# EAGLE schematic Super_Clokk_199774_2015_03_30 (EAGLE 6.4)
Assembly variants: Prototyp

## Sheet 1 of 6
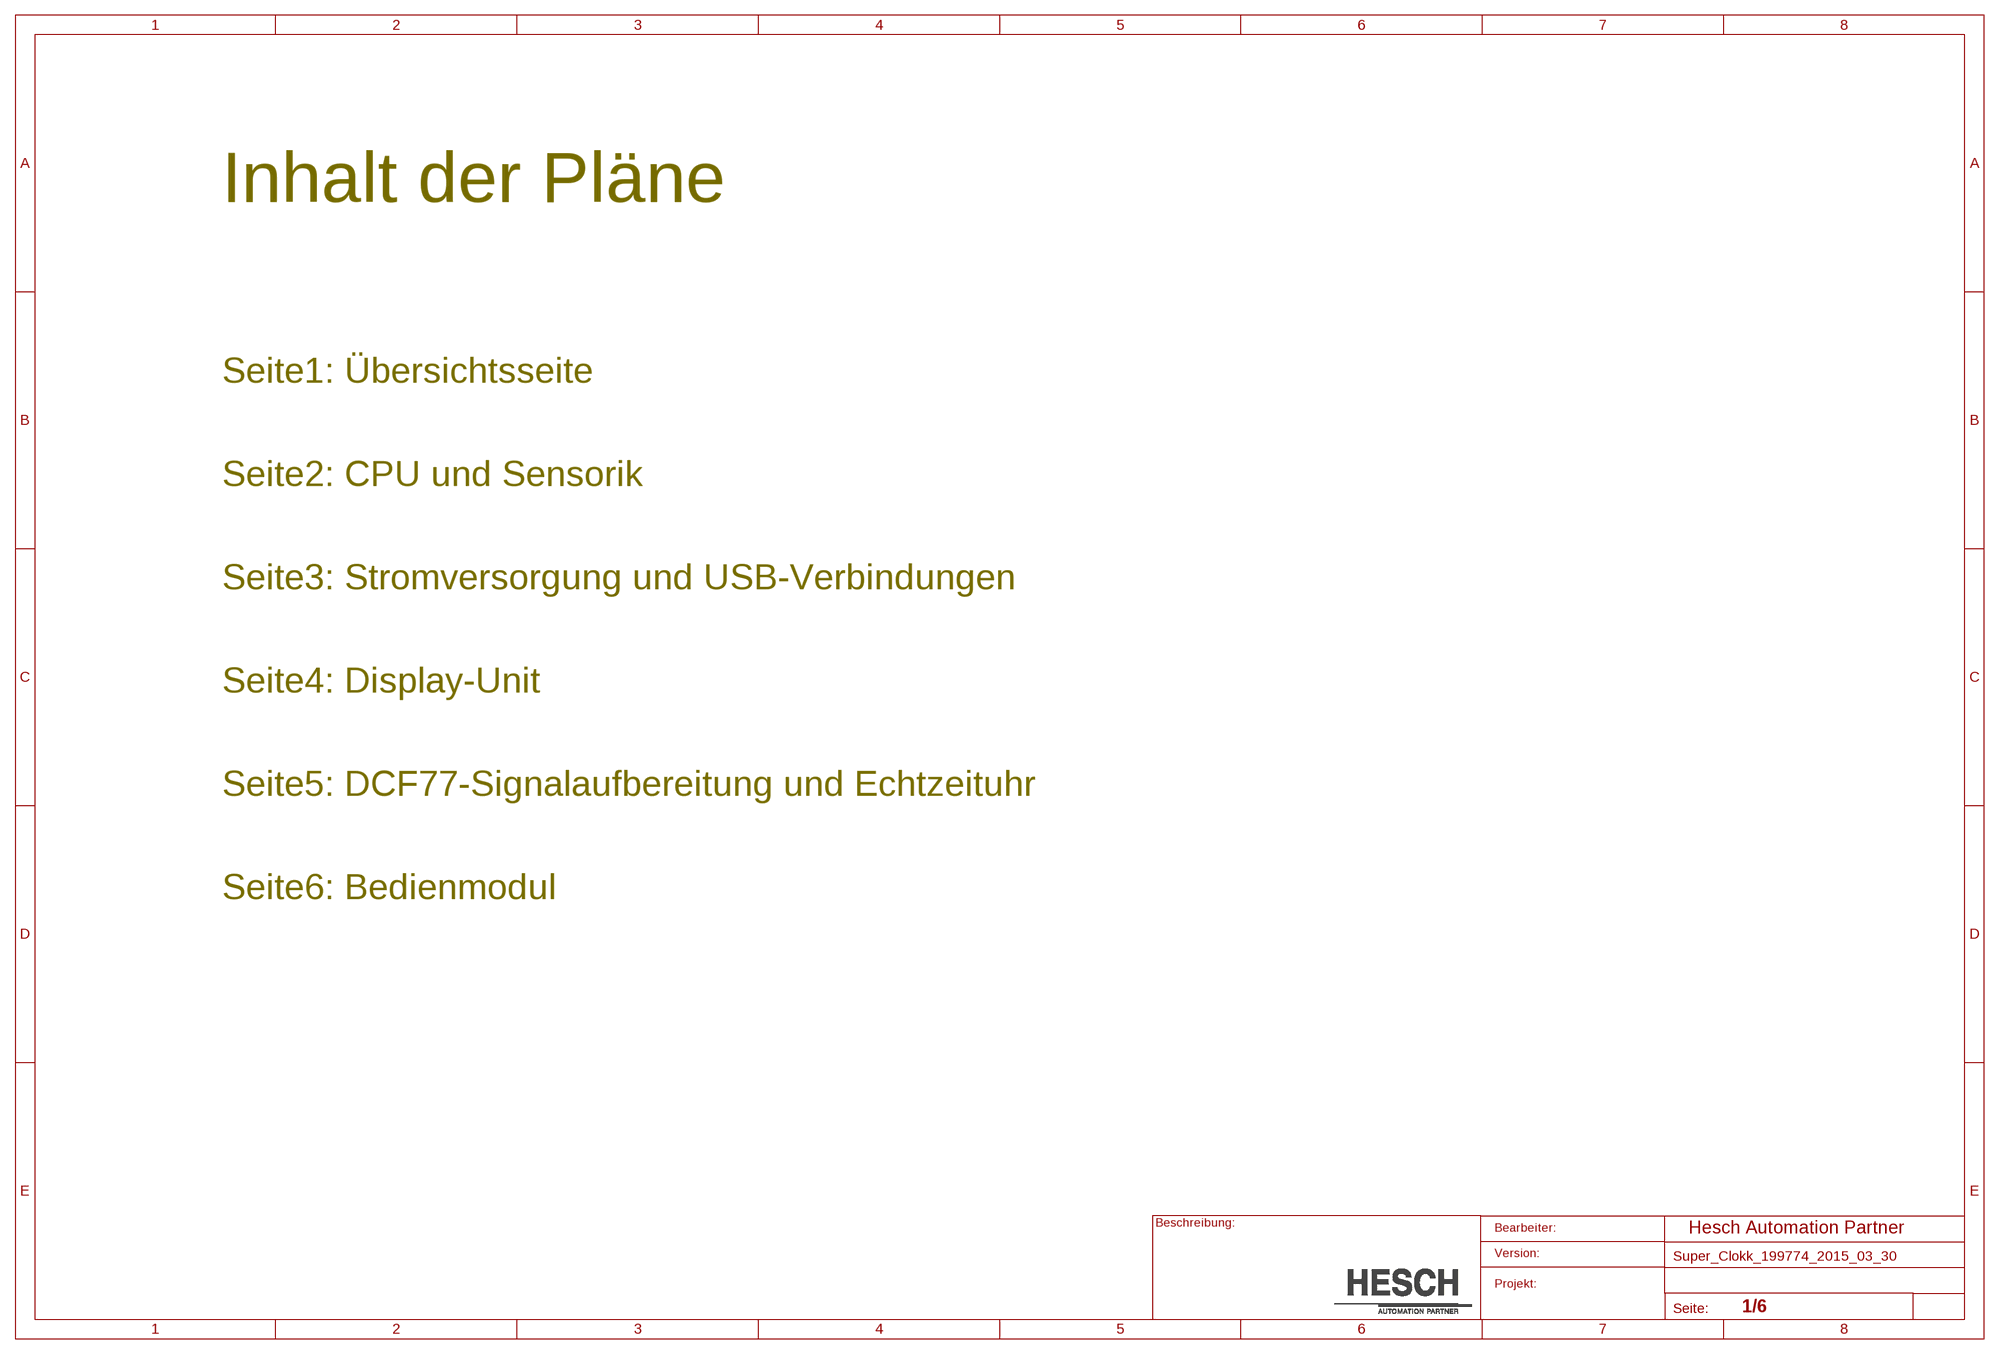
[diagram p0: schematic, sheet 1]

### Notes on the sheet
- Inhalt der Pläne
- Seite1: Übersichtsseite
- Seite2: CPU und Sensorik
- Seite3: Stromversorgung und USB-Verbindungen
- Seite4: Display-Unit
- Seite5: DCF77-Signalaufbereitung und Echtzeituhr
- Seite6: Bedienmodul

## Sheet 2 of 6
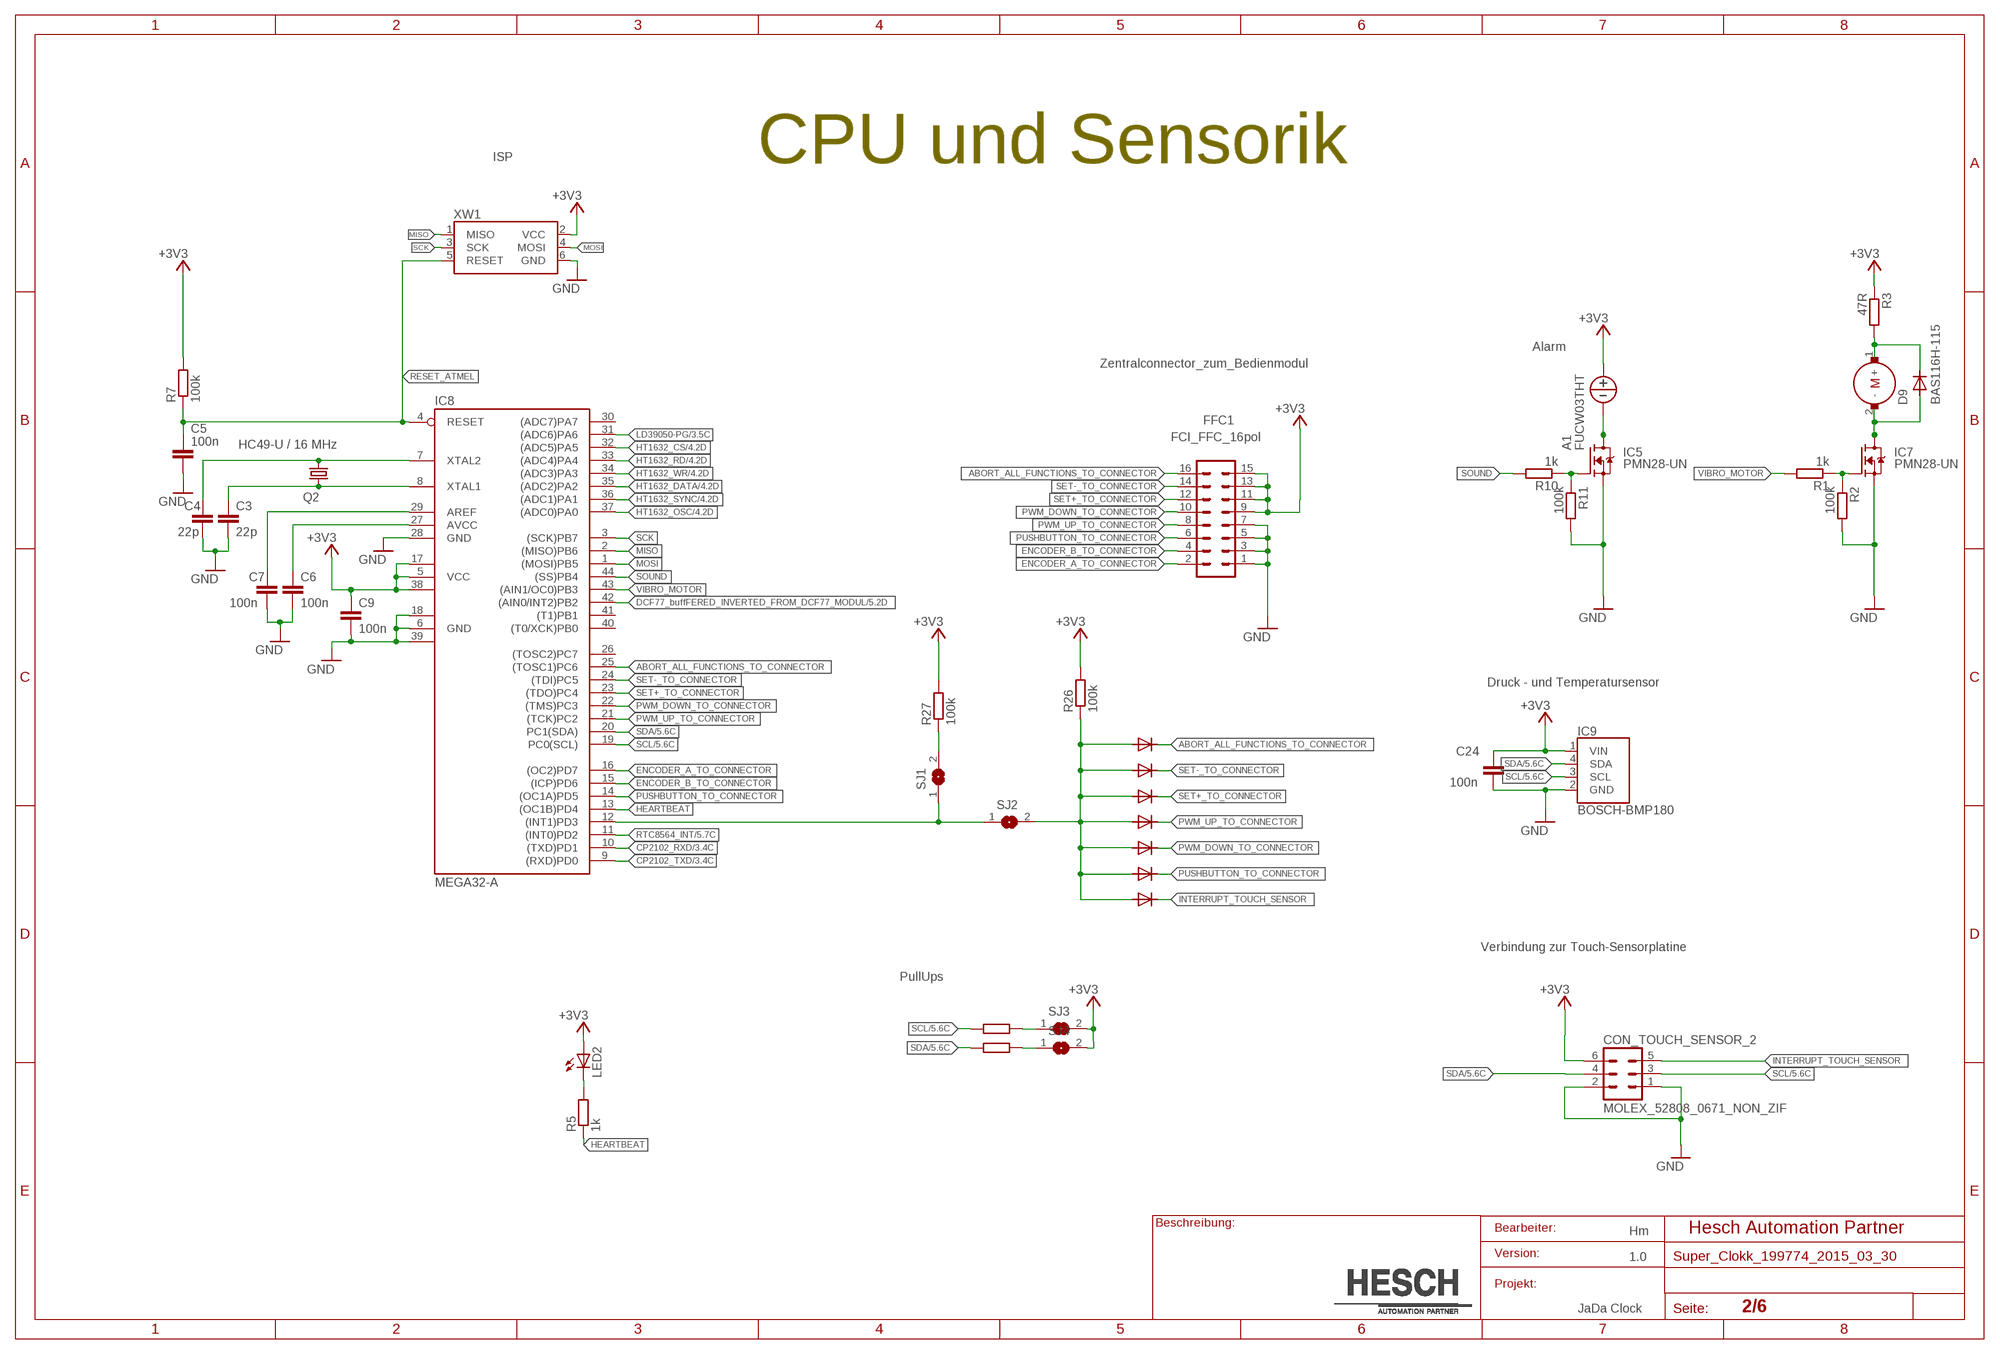
[diagram p1: schematic, sheet 2]

### Parts
A1  FUCW03THT  [FUCW03]  (not fitted in variant Prototyp)
C3  22p  C-EUC0805K  [C0805K]
C4  22p  C-EUC0805K  [C0805K]
C5  100n  C-EUC0805  [C0805]
C6  100n  C-EUC0805  [C0805]
C7  100n  C-EUC0805  [C0805]
C9  100n  C-EUC0805  [C0805]
C24  100n  C-EUC0805  [C0805]
CON_TOUCH_SENSOR_2  MOLEX_52808_0671_NON_ZIF  [MOLEX_52808-0671_NON_ZIF]
D2  BAS116H-115  [SOD123]
D3  BAS116H-115  [SOD123]
D4  BAS116H-115  [SOD123]
D5  BAS116H-115  [SOD123]
D6  BAS116H-115  [SOD123]
D8  BAS116H-115  [SOD123]
D9  BAS116H-115  [SOD123]
D10  BAS116H-115  [SOD123]
FFC1  FCI_FFC_16pol  MOLEX_52808-1671_NON_ZIF  [MOLEX_52808_1671_NON_ZIF]
IC5  PMN28-UN  [SOT457]
IC7  PMN28-UN  [SOT457]
IC8  MEGA32-A  [TQFP44]
IC9  BOSCH-BMP180  [10X13MM]
LED2  LEDCHIPLED_0805  [CHIPLED_0805]
M1  VIBROMOTORTHT432A  [LA4-432A]
Q2  HC49-U / 16 MHz  HC49-U  [HC49]
R1  1k  R-EU_R0805  [R0805]
R2  100k  R-EU_R0805  [R0805]
R3  47R  R-EU_R0805  [R0805]
R5  1k  R-EU_R0805  [R0805]
R7  100k  R-EU_R0805  [R0805]
R10  1k  R-EU_R0805  [R0805]
R11  100k  R-EU_R0805  [R0805]
R26  100k  R-EU_R0805  [R0805]
R27  100k  R-EU_R0805  [R0805]
R52  4,7k  R-EU_R0805  [R0805]
R53  4,7k  R-EU_R0805  [R0805]
SJ1  SJ  [SJ]
SJ2  SJ  [SJ]
SJ3  SJ  [SJ]
SJ4  SJ  [SJ]
XW1  WSL6  [WSL]

### Nets
+3V3: A1.+ C9.1 C24.1 CON_TOUCH_SENSOR_2.6 FFC1.9 FFC1.11 FFC1.13 FFC1.15 IC8.5(VCC) IC8.17(VCC1) IC8.38(VCC2) IC9.1(VIN) LED2.A R3.1 R7.2 R26.2 R27.2 SJ3.2 SJ4.2 XW1.2(VCC) ; also sheet 3,4,5
ABORT_ALL_FUNCTIONS_TO_CONNECTOR: D2.C FFC1.16 IC8.25((TOSC1)PC6)
AREF: C7.1 IC8.29(AREF)
AVCC: C6.1 IC8.27(AVCC)
CP2102_RXD: IC8.10((TXD)PD1) ; also sheet 3
CP2102_TXD: IC8.9((RXD)PD0) ; also sheet 3
DCF77_buffFERED_INVERTED_FROM_DCF77_MODUL: IC8.42((AIN0/INT2)PB2) ; also sheet 5
EINGABE?: D2.A D3.A D4.A D5.A D6.A D8.A D10.A R26.1 SJ2.2
ENCODER_A_TO_CONNECTOR: FFC1.2 IC8.16((OC2)PD7)
ENCODER_B_TO_CONNECTOR: FFC1.4 IC8.15((ICP)PD6)
GND: C3.2 C4.2 C5.2 C6.2 C7.2 C9.2 C24.2 CON_TOUCH_SENSOR_2.1 CON_TOUCH_SENSOR_2.2 FFC1.1 FFC1.3 FFC1.5 FFC1.7 IC5.4(S) IC7.4(S) IC8.6(GND) IC8.18(GND1) IC8.28(GND) IC8.39(GND2) IC9.2(GND) R2.2 R11.2 XW1.6(GND) ; also sheet 3,4,5
HEARTBEAT: IC8.13((OC1B)PD4) R5.1
HT1632_CS: IC8.32((ADC5)PA5) ; also sheet 4
HT1632_DATA: IC8.35((ADC2)PA2) ; also sheet 4
HT1632_OSC: IC8.37((ADC0)PA0) ; also sheet 4
HT1632_RD: IC8.33((ADC4)PA4) ; also sheet 4
HT1632_SYNC: IC8.36((ADC1)PA1) ; also sheet 4
HT1632_WR: IC8.34((ADC3)PA3) ; also sheet 4
INTERRUPT_TOUCH_SENSOR: CON_TOUCH_SENSOR_2.5 D8.C
LD39050-PG: IC8.31((ADC6)PA6) ; also sheet 3
MISO: IC8.2((MISO)PB6) XW1.1(MISO)
MOSI: IC8.1((MOSI)PB5) XW1.4(MOSI)
N$1: A1.- IC5.1(D) IC5.2(D) IC5.5(D) IC5.6(D)
N$2: R52.2 SJ3.1
N$3: R53.2 SJ4.1
N$5: IC7.3(G) R1.1 R2.1
N$8: D9.A IC7.1(D) IC7.2(D) IC7.5(D) IC7.6(D) M1.2(-)
N$9: D9.C M1.1(+) R3.2
N$15: IC5.3(G) R10.1 R11.1
N$16: LED2.C R5.2
N$24: IC8.12((INT1)PD3) SJ1.1 SJ2.1
N$50: R27.1 SJ1.2
PUSHBUTTON_TO_CONNECTOR: D6.C FFC1.6 IC8.14((OC1A)PD5)
PWM_DOWN_TO_CONNECTOR: D10.C FFC1.10 IC8.22((TMS)PC3)
PWM_UP_TO_CONNECTOR: D5.C FFC1.8 IC8.21((TCK)PC2)
RESET_ATMEL: C5.1 IC8.4(RESET) R7.1 XW1.5(RESET)
RTC8564_INT: IC8.11((INT0)PD2) ; also sheet 5
SCK: IC8.3((SCK)PB7) XW1.3(SCK)
SCL: CON_TOUCH_SENSOR_2.3 IC8.19(PC0(SCL)) IC9.3(SCL) R52.1 ; also sheet 5
SDA: CON_TOUCH_SENSOR_2.4 IC8.20(PC1(SDA)) IC9.4(SDA) R53.1 ; also sheet 5
SET+_TO_CONNECTOR: D4.C FFC1.12 IC8.23((TDO)PC4)
SET-_TO_CONNECTOR: D3.C FFC1.14 IC8.24((TDI)PC5)
SOUND: IC8.44((SS)PB4) R10.2
VIBRO_MOTOR: IC8.43((AIN1/OC0)PB3) R1.2
XTAL_1: C3.1 IC8.8(XTAL1) Q2.1
XTAL_2: C4.1 IC8.7(XTAL2) Q2.2
Unconnected: IC8.26((TOSC2)PC7) IC8.30((ADC7)PA7) IC8.40((T0/XCK)PB0) IC8.41((T1)PB1)

### Notes on the sheet
- ISP | CPU und Sensorik
- Alarm
- Zentralconnector_zum_Bedienmodul
- Druck - und Temperatursensor
- Verbindung zur Touch-Sensorplatine
- PullUps
- Hm
- 1.0
- JaDa Clock

## Sheet 3 of 6
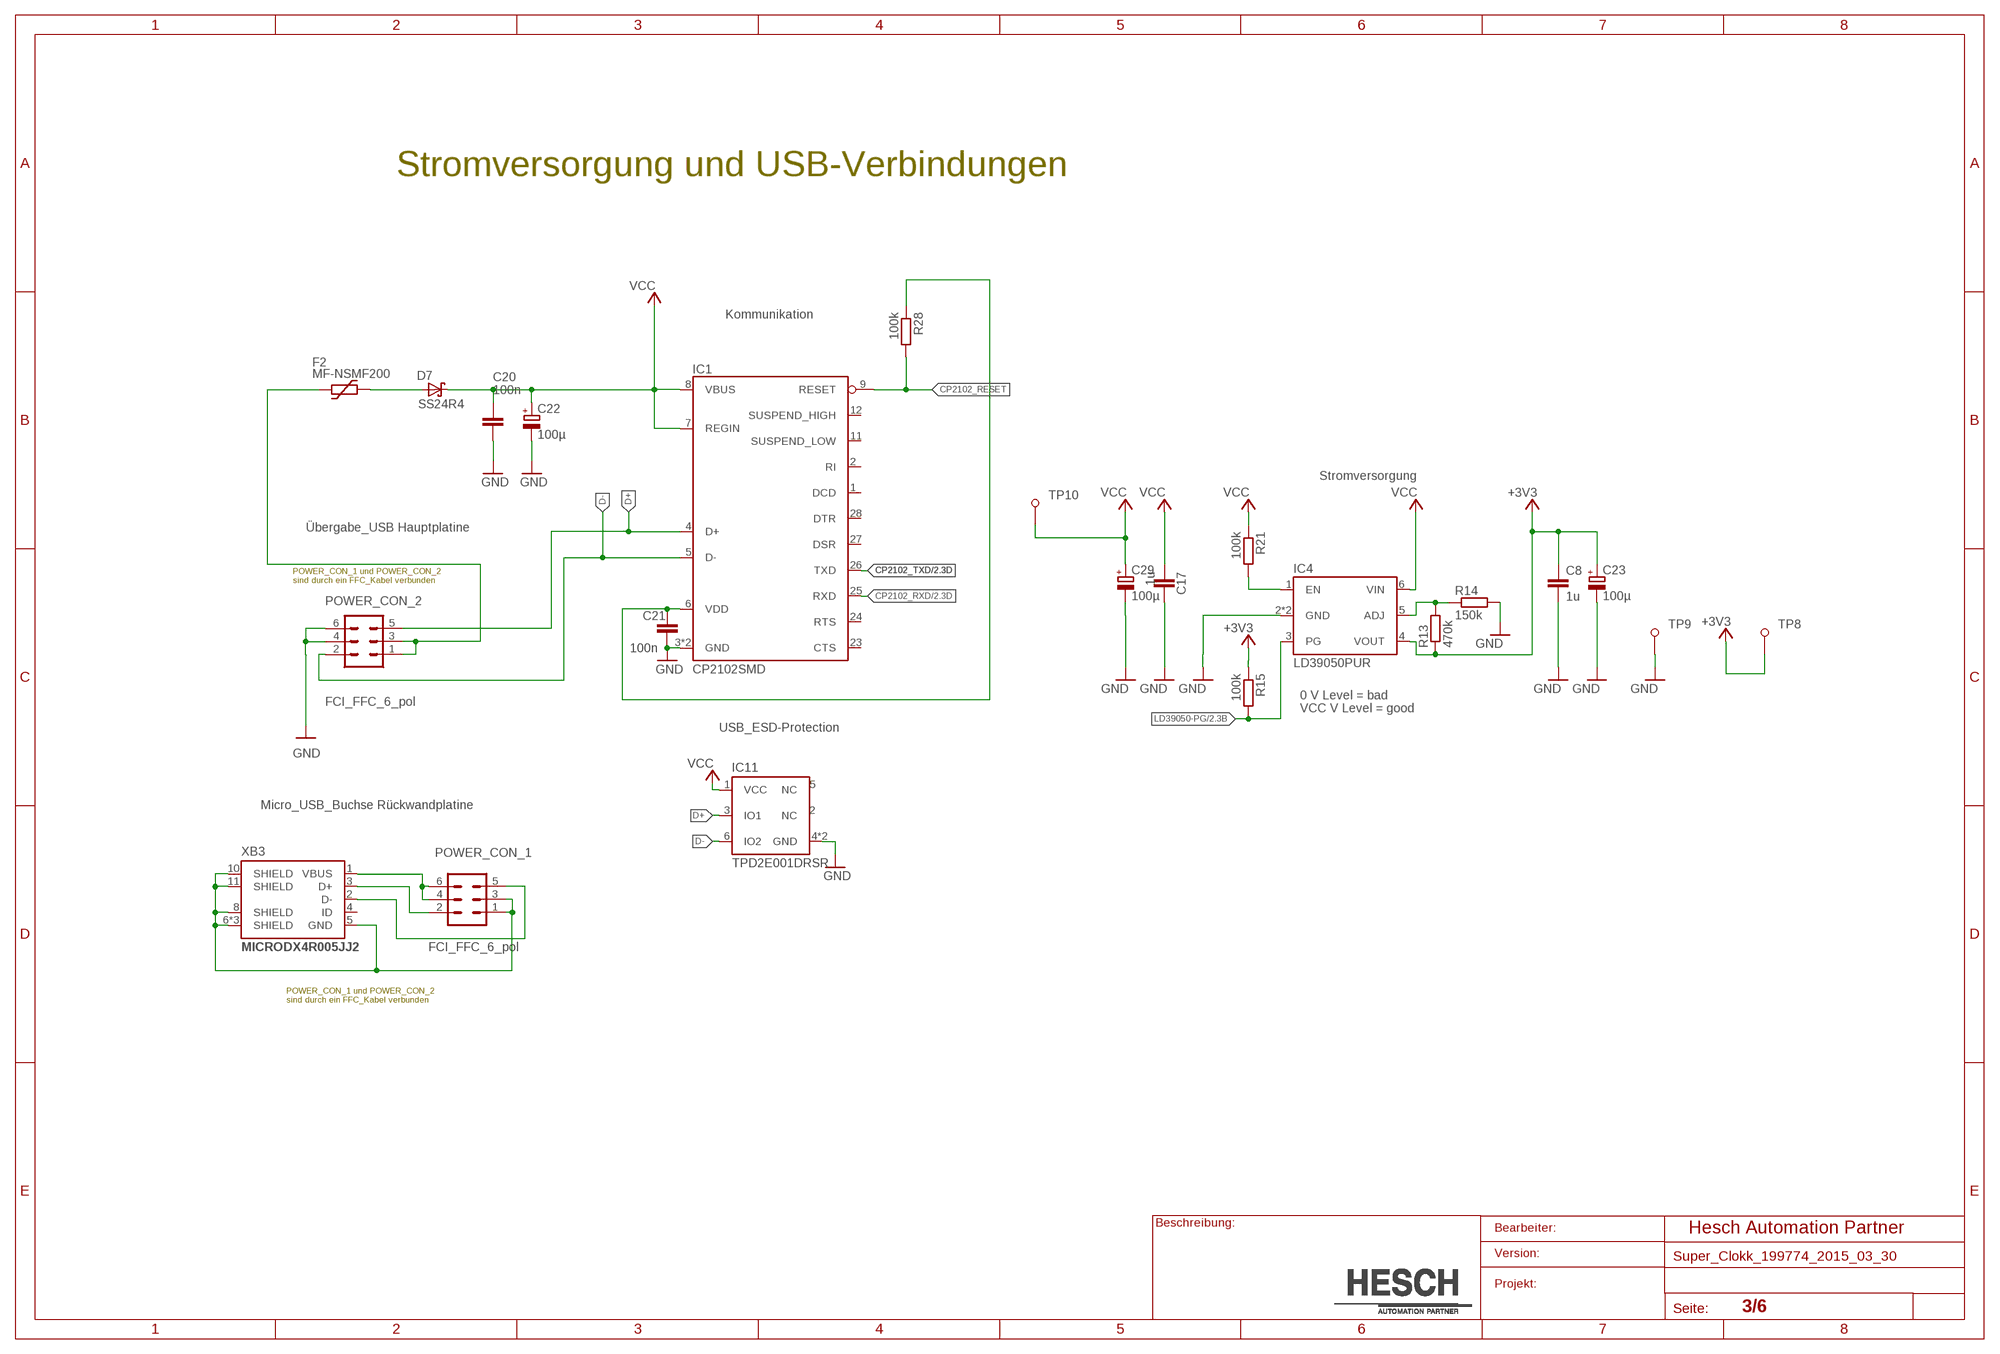
[diagram p2: schematic, sheet 3]

### Parts
C8  1u  C-EUC0805K  [C0805K]
C17  1u  C-EUC0805K  [C0805K]
C20  100n  C-EUC0805  [C0805]
C21  100n  C-EUC0805  [C0805]
C22  100µ  CPOL-EUSMCD  [SMC_D]
C23  100µ  CPOL-EUSMCD  [SMC_D]
C29  100µ  CPOL-EUSMCD  [SMC_D]
D7  SS24R4  [DO-214AA/SMB]
F2  MF-NSMF200  1206L-MF-NSMF050-2  [1206L]
IC1  CP2102SMD  [QFN28]
IC4  LD39050PUR  [DFN6]
IC11  TPD2E001DRSR  [DRS]
POWER_CON_1  FCI_FFC_6_pol  MOLEX_52808_0671_NON_ZIF  [MOLEX_52808-0671_NON_ZIF]
POWER_CON_2  FCI_FFC_6_pol  MOLEX_52808_0671_NON_ZIF  [MOLEX_52808-0671_NON_ZIF]
R13  470k  R-EU_R0603  [R0603]
R14  150k  R-EU_R0603  [R0603]
R15  100k  R-EU_R0805  [R0805]
R21  100k  R-EU_R0805  [R0805]
R28  100k  R-EU_R0805  [R0805]
TP8  PAD´S8  [THT-1X2,54]
TP9  PAD´S8  [THT-1X2,54]
TP10  PAD´S8  [THT-1X2,54]
XB3  MICRODX4R005JJ2  [MICRO_NEU]

### Nets
+3V3: C8.1 C23.+ IC4.4(VOUT) R13.1 R15.1 TP8.TP ; also sheet 2,4,5
CP2102_RESET: IC1.9(RESET) R28.2
CP2102_RXD: IC1.25(RXD) ; also sheet 2
CP2102_TXD: IC1.26(TXD) ; also sheet 2
D+: IC1.4(D+) IC11.3(IO1) POWER_CON_2.5
D-: IC1.5(D-) IC11.6(IO2) POWER_CON_2.2
GND: C8.2 C17.2 C20.2 C21.2 C22.- C23.- C29.- IC1.3(GND) IC1.THERMAL(GND) IC4.2(GND) IC4.EXP(GND) IC11.4(GND) IC11.THERMAL(GND) POWER_CON_2.4 POWER_CON_2.6 R14.2 TP9.TP ; also sheet 2,4,5
GND_USB_RüCKWAND: POWER_CON_1.1 POWER_CON_1.3 XB3.5(GND) XB3.6(SHIELD) XB3.7(SHIELD) XB3.8(SHIELD) XB3.9(SHIELD) XB3.10(SHIELD) XB3.11(SHIELD)
LD39050-PG: IC4.3(PG) R15.2 ; also sheet 2
N$6: C21.1 IC1.6(VDD) R28.1
N$7: D7.A F2.2
N$11: IC4.1(EN) R21.2
N$14: IC4.5(ADJ) R13.2 R14.1
POWER_FROM_USB_RüCKWAND: F2.1 POWER_CON_2.1 POWER_CON_2.3
USB_D+: POWER_CON_1.2 XB3.3(D+)
USB_D-: POWER_CON_1.5 XB3.2(D-)
VBUS_USB_RüCKWAND: POWER_CON_1.4 POWER_CON_1.6 XB3.1(VBUS)
VCC: C17.1 C20.1 C22.+ C29.+ D7.C IC1.7(REGIN) IC1.8(VBUS) IC4.6(VIN) IC11.1(VCC) R21.1 TP10.TP
Unconnected: IC1.1(DCD) IC1.2(RI) IC1.11(SUSPEND_LOW) IC1.12(SUSPEND_HIGH) IC1.23(CTS) IC1.24(RTS) IC1.27(DSR) IC1.28(DTR) IC11.2(NC) IC11.5(NC) XB3.4(ID)

### Notes on the sheet
- Stromversorgung und USB-Verbindungen
- Kommunikation
- Stromversorgung
- Übergabe_USB Hauptplatine
- POWER_CON_1 und POWER_CON_2
  sind durch ein FFC_Kabel verbunden
- 0 V Level = bad
- VCC V Level = good
- USB_ESD-Protection
- Micro_USB_Buchse Rückwandplatine
- POWER_CON_1 und POWER_CON_2
  sind durch ein FFC_Kabel verbunden

## Sheet 4 of 6
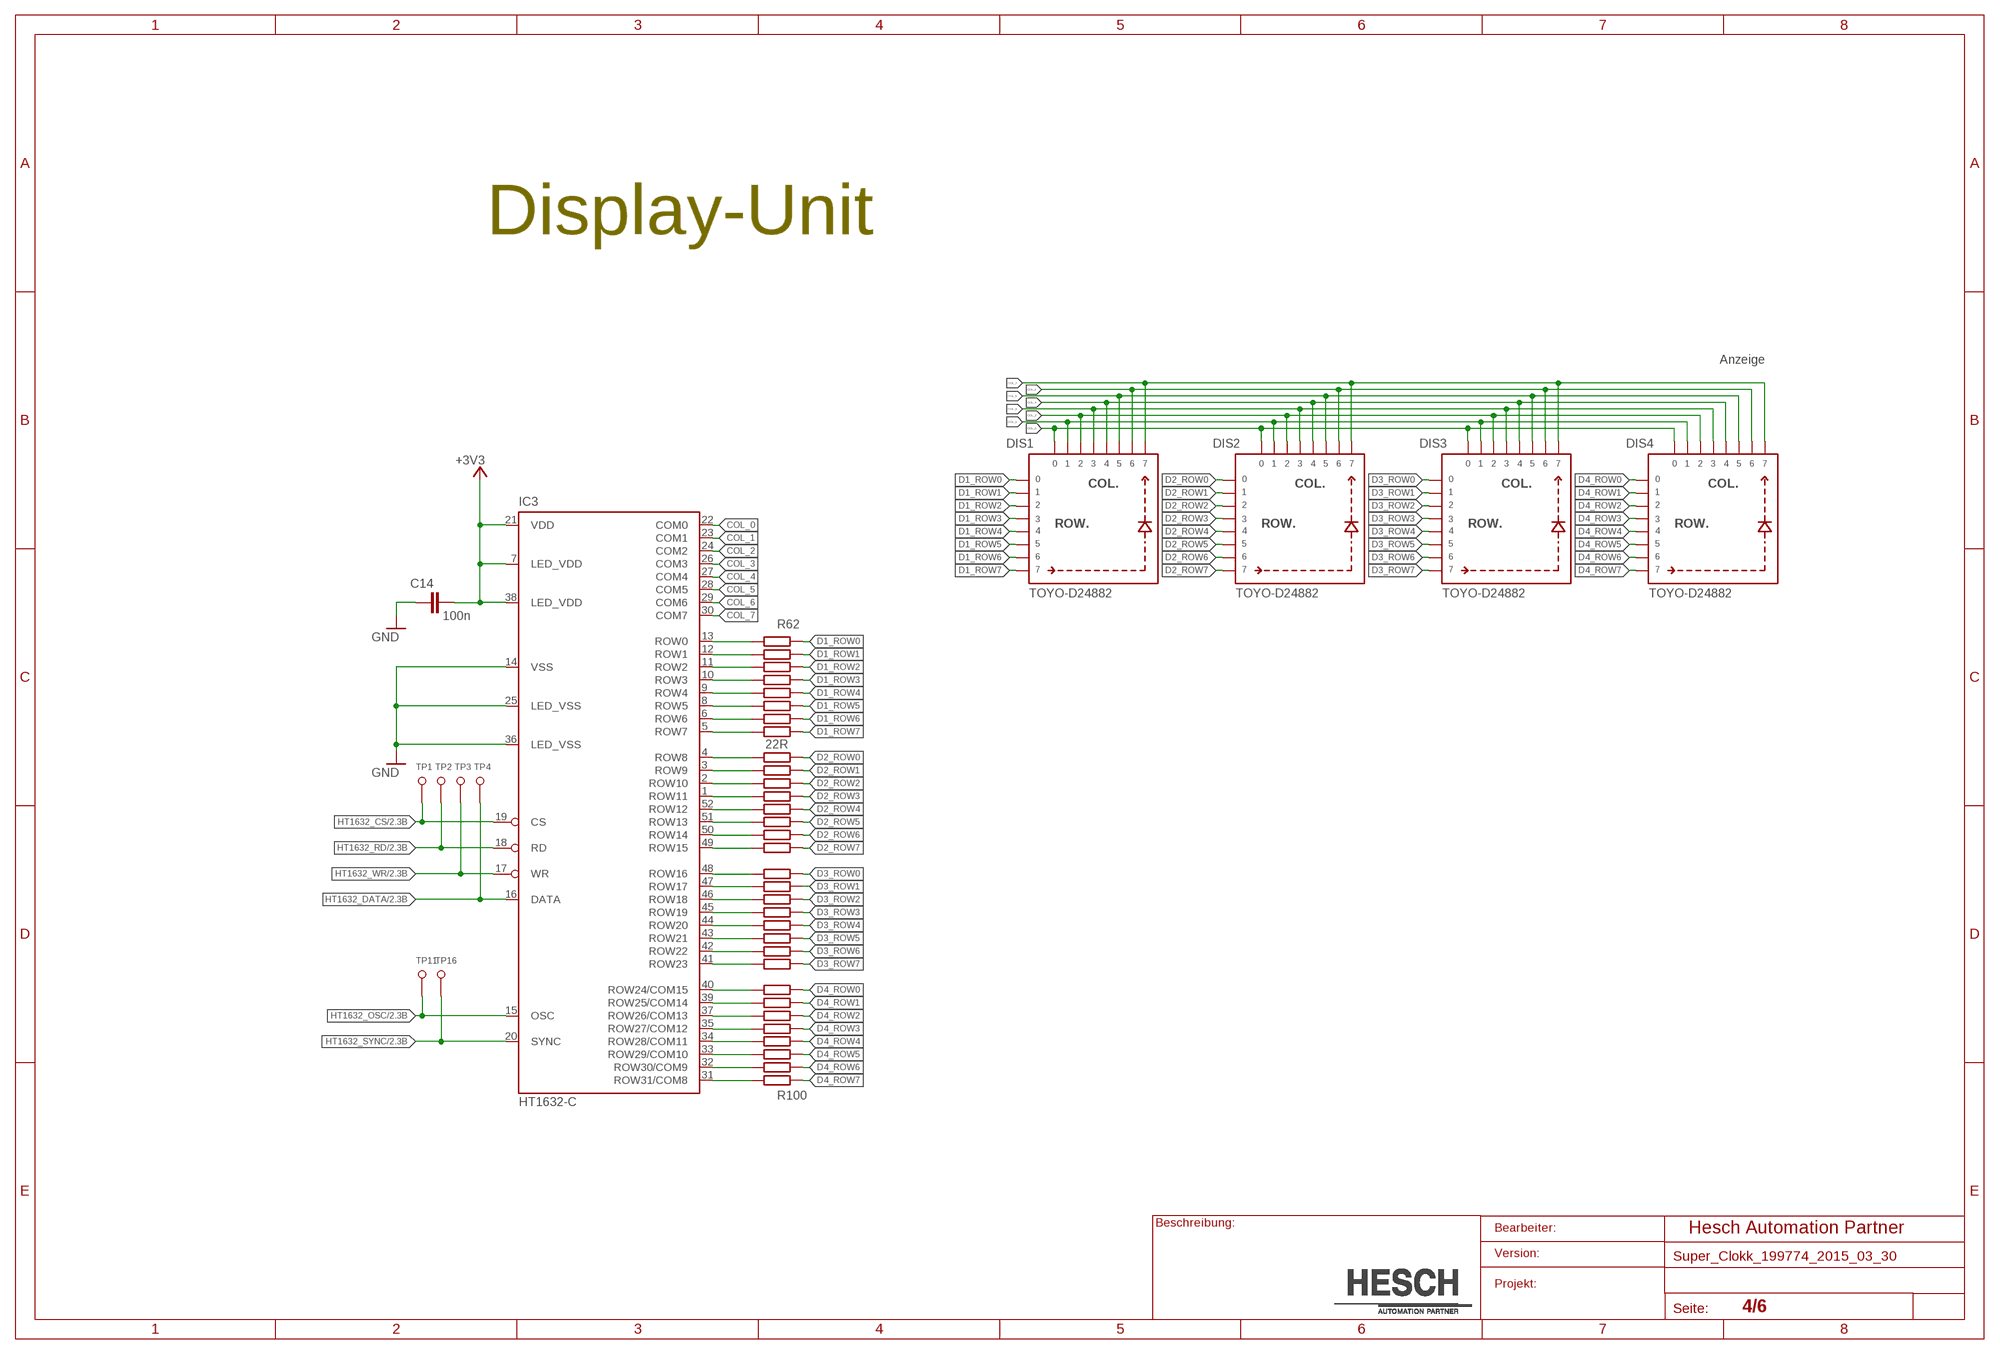
[diagram p3: schematic, sheet 4]

### Parts
C14  100n  C-EUC0805  [C0805]
DIS1  TOYO-D24882  [TOYO]
DIS2  TOYO-D24882  [TOYO]
DIS3  TOYO-D24882  [TOYO]
DIS4  TOYO-D24882  [TOYO]
IC3  HT1632-C  [52PIN_OFP]
R62  22R  R-EU_R0805  [R0805]
R63  22R  R-EU_R0805  [R0805]
R65  22R  R-EU_R0805  [R0805]
R66  22R  R-EU_R0805  [R0805]
R67  22R  R-EU_R0805  [R0805]
R74  22R  R-EU_R0805  [R0805]
R75  22R  R-EU_R0805  [R0805]
R76  22R  R-EU_R0805  [R0805]
R77  22R  R-EU_R0805  [R0805]
R78  22R  R-EU_R0805  [R0805]
R79  22R  R-EU_R0805  [R0805]
R80  22R  R-EU_R0805  [R0805]
R81  22R  R-EU_R0805  [R0805]
R82  22R  R-EU_R0805  [R0805]
R83  22R  R-EU_R0805  [R0805]
R84  22R  R-EU_R0805  [R0805]
R85  22R  R-EU_R0805  [R0805]
R86  22R  R-EU_R0805  [R0805]
R87  22R  R-EU_R0805  [R0805]
R88  22R  R-EU_R0805  [R0805]
R89  22R  R-EU_R0805  [R0805]
R90  22R  R-EU_R0805  [R0805]
R91  22R  R-EU_R0805  [R0805]
R92  22R  R-EU_R0805  [R0805]
R93  22R  R-EU_R0805  [R0805]
R94  22R  R-EU_R0805  [R0805]
R95  22R  R-EU_R0805  [R0805]
R96  22R  R-EU_R0805  [R0805]
R97  22R  R-EU_R0805  [R0805]
R98  22R  R-EU_R0805  [R0805]
R99  22R  R-EU_R0805  [R0805]
R100  22R  R-EU_R0805  [R0805]
TP1  PAD´S8  [THT-1X2,54]
TP2  PAD´S8  [THT-1X2,54]
TP3  PAD´S8  [THT-1X2,54]
TP4  PAD´S8  [THT-1X2,54]
TP11  PAD´S8  [THT-1X2,54]
TP16  PAD´S8  [THT-1X2,54]

### Nets
+3V3: C14.2 IC3.7(LED_VDD) IC3.21(VDD) IC3.38(LED_VDD) ; also sheet 2,3,5
COL_0: DIS1.1 DIS2.1 DIS3.1 DIS4.1 IC3.22(COM0)
COL_1: DIS1.2 DIS2.2 DIS3.2 DIS4.2 IC3.23(COM1)
COL_2: DIS1.3 DIS2.3 DIS3.3 DIS4.3 IC3.24(COM2)
COL_3: DIS1.4 DIS2.4 DIS3.4 DIS4.4 IC3.26(COM3)
COL_4: DIS1.12 DIS2.12 DIS3.12 DIS4.12 IC3.27(COM4)
COL_5: DIS1.11 DIS2.11 DIS3.11 DIS4.11 IC3.28(COM5)
COL_6: DIS1.10 DIS2.10 DIS3.10 DIS4.10 IC3.29(COM6)
COL_7: DIS1.9 DIS2.9 DIS3.9 DIS4.9 IC3.30(COM7)
D1_ROW0: DIS1.16 R62.1
D1_ROW1: DIS1.15 R63.1
D1_ROW2: DIS1.14 R65.1
D1_ROW3: DIS1.13 R66.1
D1_ROW4: DIS1.5 R67.1
D1_ROW5: DIS1.6 R74.1
D1_ROW6: DIS1.7 R75.1
D1_ROW7: DIS1.8 R76.1
D2_ROW0: DIS2.16 R77.1
D2_ROW1: DIS2.15 R78.1
D2_ROW2: DIS2.14 R79.1
D2_ROW3: DIS2.13 R80.1
D2_ROW4: DIS2.5 R81.1
D2_ROW5: DIS2.6 R82.1
D2_ROW6: DIS2.7 R83.1
D2_ROW7: DIS2.8 R84.1
D3_ROW0: DIS3.16 R85.1
D3_ROW1: DIS3.15 R86.1
D3_ROW2: DIS3.14 R87.1
D3_ROW3: DIS3.13 R88.1
D3_ROW4: DIS3.5 R89.1
D3_ROW5: DIS3.6 R90.1
D3_ROW6: DIS3.7 R91.1
D3_ROW7: DIS3.8 R92.1
D4_ROW0: DIS4.16 R93.1
D4_ROW1: DIS4.15 R94.1
D4_ROW2: DIS4.14 R95.1
D4_ROW3: DIS4.13 R96.1
D4_ROW4: DIS4.5 R97.1
D4_ROW5: DIS4.6 R98.1
D4_ROW6: DIS4.7 R99.1
D4_ROW7: DIS4.8 R100.1
GND: C14.1 IC3.14(VSS) IC3.25(LED_VSS) IC3.36(LED_VSS) ; also sheet 2,3,5
HT1632_CS: IC3.19(CS) TP1.TP ; also sheet 2
HT1632_DATA: IC3.16(DATA) TP4.TP ; also sheet 2
HT1632_OSC: IC3.15(OSC) TP11.TP ; also sheet 2
HT1632_RD: IC3.18(RD) TP2.TP ; also sheet 2
HT1632_SYNC: IC3.20(SYNC) TP16.TP ; also sheet 2
HT1632_WR: IC3.17(WR) TP3.TP ; also sheet 2
N$10: IC3.13(ROW0) R62.2
N$13: IC3.12(ROW1) R63.2
N$18: IC3.11(ROW2) R65.2
N$20: IC3.10(ROW3) R66.2
N$21: IC3.9(ROW4) R67.2
N$53: IC3.8(ROW5) R74.2
N$56: IC3.6(ROW6) R75.2
N$57: IC3.5(ROW7) R76.2
N$58: IC3.4(ROW8) R77.2
N$59: IC3.3(ROW9) R78.2
N$60: IC3.2(ROW10) R79.2
N$61: IC3.1(ROW11) R80.2
N$62: IC3.52(ROW12) R81.2
N$63: IC3.51(ROW13) R82.2
N$64: IC3.50(ROW14) R83.2
N$65: IC3.49(ROW15) R84.2
N$66: IC3.48(ROW16) R85.2
N$67: IC3.47(ROW17) R86.2
N$68: IC3.46(ROW18) R87.2
N$69: IC3.45(ROW19) R88.2
N$70: IC3.44(ROW20) R89.2
N$71: IC3.43(ROW21) R90.2
N$72: IC3.42(ROW22) R91.2
N$73: IC3.41(ROW23) R92.2
N$74: IC3.40(ROW24/COM15) R93.2
N$75: IC3.39(ROW25/COM14) R94.2
N$76: IC3.37(ROW26/COM13) R95.2
N$85: IC3.35(ROW27/COM12) R96.2
N$86: IC3.34(ROW28/COM11) R97.2
N$87: IC3.33(ROW29/COM10) R98.2
N$88: IC3.32(ROW30/COM9) R99.2
N$89: IC3.31(ROW31/COM8) R100.2

### Notes on the sheet
- Display-Unit
- Anzeige

## Sheet 5 of 6
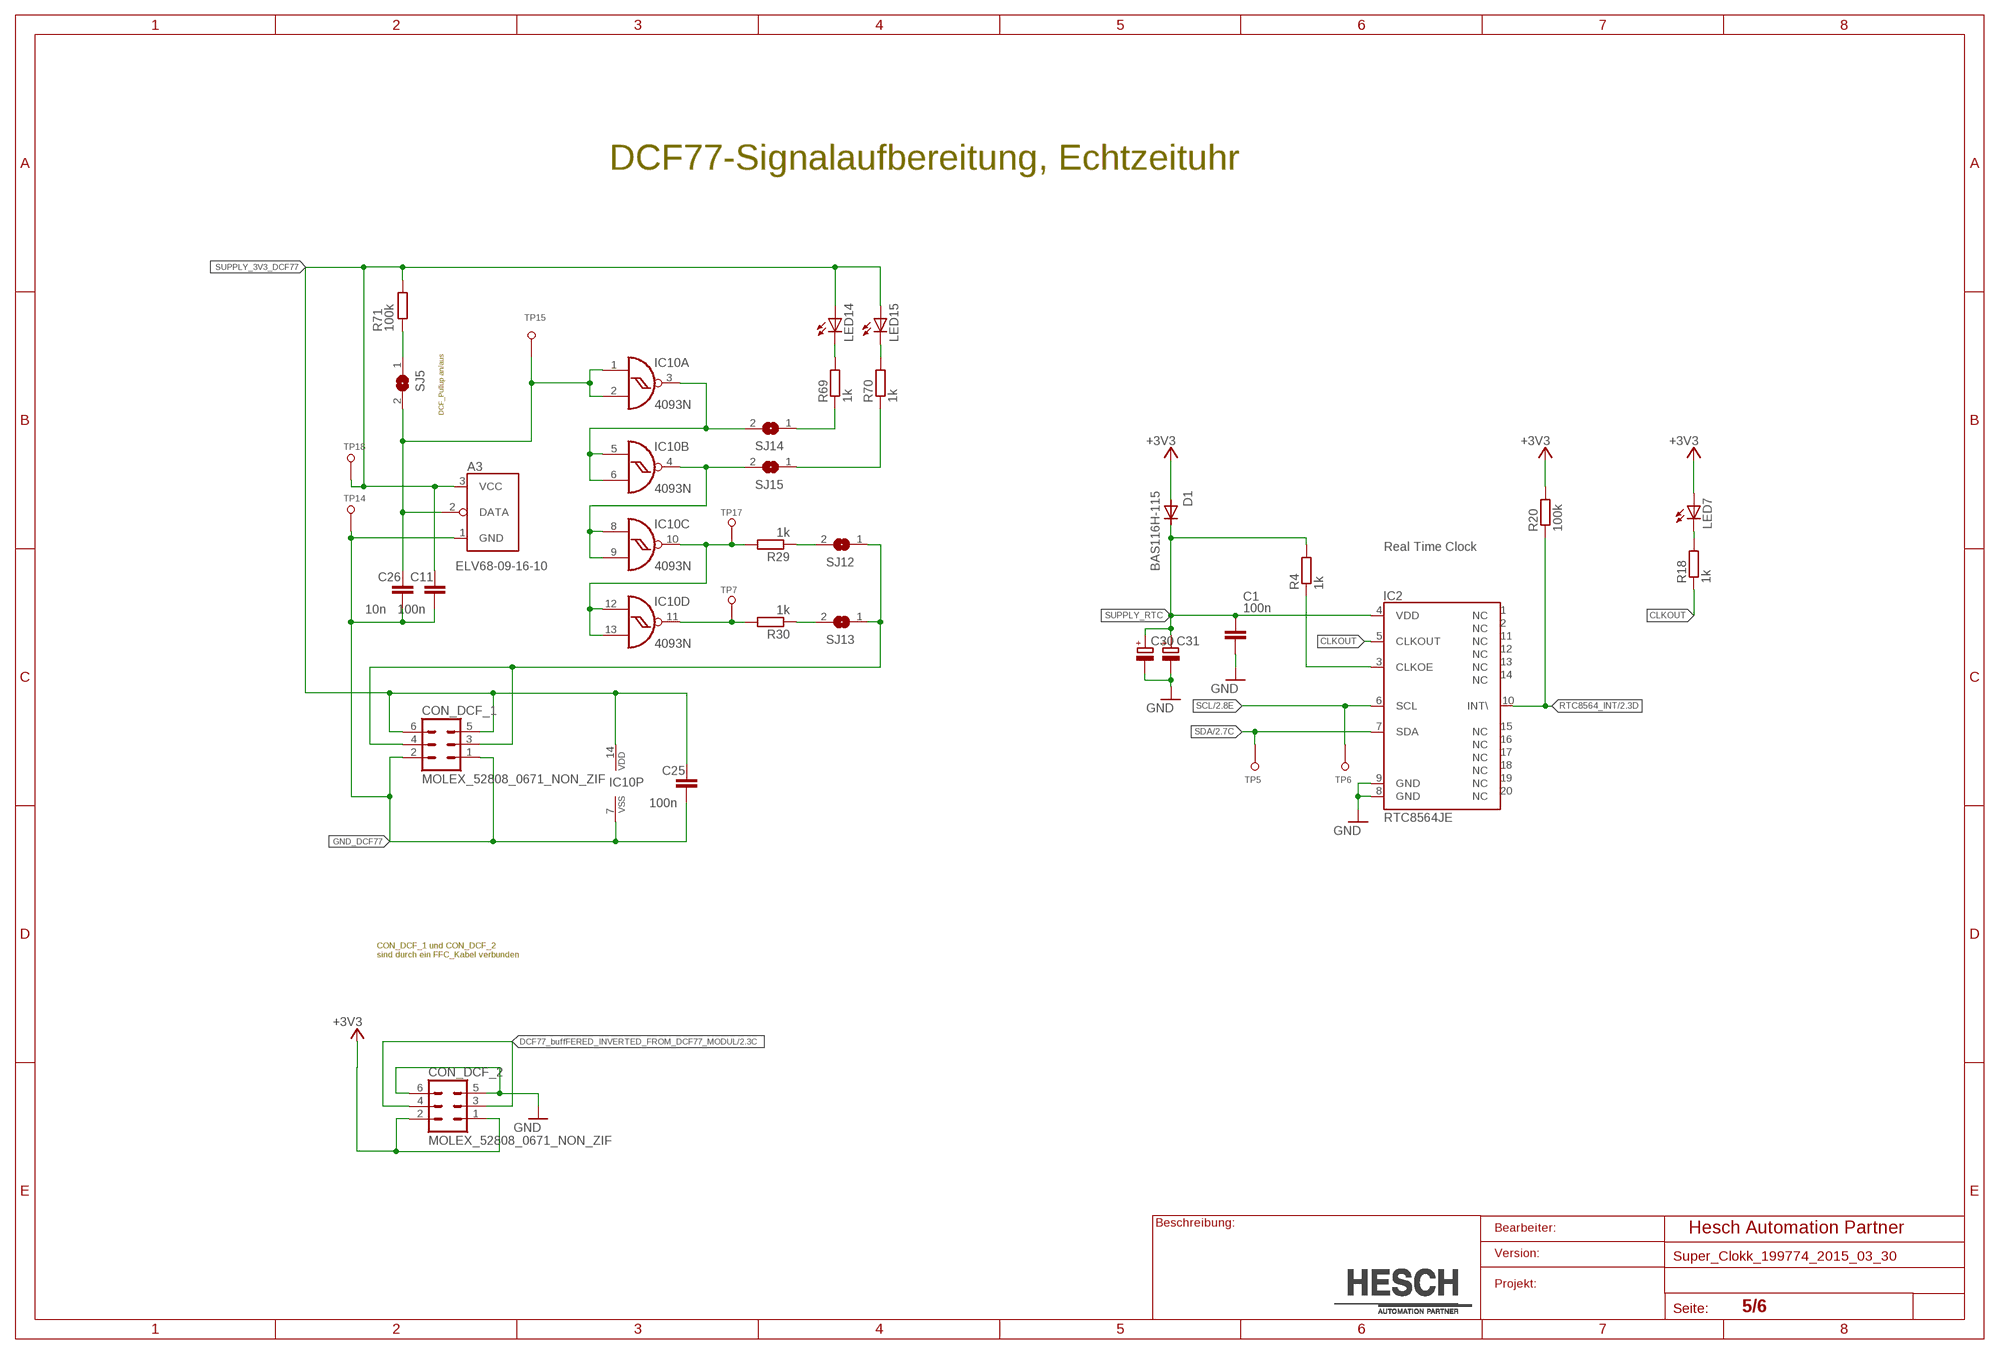
[diagram p4: schematic, sheet 5]

### Parts
A3  ELV68-09-16-10  [18X23MM]
C1  100n  C-EUC0805  [C0805]
C11  100n  C-EUC0805  [C0805]
C25  100n  C-EUC0805  [C0805]
C26  10n  C-EUC0805  [C0805]
C30  PANASONIC-EN&SD-SERIESTHT_1  [PANASONIC_SD_SERIES_STEHEND]
C31  PANASONIC-EN&SD-SERIESTHT  [PANASONIC_SD_SERIES_LIEGEND]
CON_DCF_1  MOLEX_52808_0671_NON_ZIF  [MOLEX_52808-0671_NON_ZIF]
CON_DCF_2  MOLEX_52808_0671_NON_ZIF  [MOLEX_52808-0671_NON_ZIF]
D1  BAS116H-115  [SOD123]
IC2  RTC8564JESMD  [VSOJ20]
IC10  4093N  [DIL14]
LED7  LEDCHIPLED_0805  [CHIPLED_0805]
LED14  LEDCHIPLED_0805  [CHIPLED_0805]
LED15  LEDCHIPLED_0805  [CHIPLED_0805]
R4  1k  R-EU_R0805  [R0805]
R18  1k  R-EU_R0805  [R0805]
R20  100k  R-EU_R0805  [R0805]
R29  1k  R-EU_R0805  [R0805]
R30  1k  R-EU_R0805  [R0805]
R69  1k  R-EU_R0805  [R0805]
R70  1k  R-EU_R0805  [R0805]
R71  100k  R-EU_R0805  [R0805]
SJ5  SJ  [SJ]
SJ12  SJ  [SJ]
SJ13  SJ  [SJ]
SJ14  SJ  [SJ]
SJ15  SJ  [SJ]
TP5  PAD´S8  [THT-1X2,54]
TP6  PAD´S8  [THT-1X2,54]
TP7  PAD´S8  [THT-1X2,54]
TP14  PAD´S8  [THT-1X2,54]
TP15  PAD´S8  [THT-1X2,54]
TP17  PAD´S8  [THT-1X2,54]
TP18  PAD´S8  [THT-1X2,54]

### Nets
+3V3: CON_DCF_2.1 CON_DCF_2.2 D1.A LED7.A R20.2 ; also sheet 2,3,4
CLKOUT: IC2.5(CLKOUT) R18.1
DCF77_buffF_INVERTED: IC10.4(B:O) IC10.8(C:I0) IC10.9(C:I1) SJ15.2
DCF77_buffF_NON_INVERTED: IC10.10(C:O) IC10.12(D:I0) IC10.13(D:I1) R29.2 TP17.TP
DCF77_buffF_OUT_SWITCHABLE: CON_DCF_1.3 CON_DCF_1.4 SJ12.1 SJ13.1
DCF77_buffFERED_INVERTED_FROM_DCF77_MODUL: CON_DCF_2.3 CON_DCF_2.4 ; also sheet 2
DCF77_MODUL_OUT_INVERTED: A3.2(DATA) C26.1 IC10.1(A:I0) IC10.2(A:I1) SJ5.2 TP15.TP
GND: C1.2 C30.- C31.MINUS(-) CON_DCF_2.5 CON_DCF_2.6 IC2.8(GND) IC2.9(GND) ; also sheet 2,3,4
GND_DCF77: A3.1(GND) C11.2 C25.2 C26.2 CON_DCF_1.1 CON_DCF_1.2 IC10.7(P:VSS) TP14.TP
N$4: R71.2 SJ5.1
N$12: IC2.3(CLKOE) R4.1
N$19: IC10.3(A:O) IC10.5(B:I0) IC10.6(B:I1) SJ14.2
N$26: LED7.C R18.2
N$38: IC10.11(D:O) R30.2 TP7.TP
N$39: R29.1 SJ12.2
N$40: R30.1 SJ13.2
N$41: R69.1 SJ14.1
N$42: R70.1 SJ15.1
N$54: LED14.C R69.2
N$55: LED15.C R70.2
RTC8564_INT: IC2.10(INT\) R20.1 ; also sheet 2
SCL: IC2.6(SCL) TP6.TP ; also sheet 2
SDA: IC2.7(SDA) TP5.TP ; also sheet 2
SUPPLY_3V3_DCF77: A3.3(VCC) C11.1 C25.1 CON_DCF_1.5 CON_DCF_1.6 IC10.14(P:VDD) LED14.A LED15.A R71.1 TP18.TP
SUPPLY_RTC: C1.1 C30.+ C31.PLUS(+) D1.C IC2.4(VDD) R4.2
Unconnected: IC2.1(NC) IC2.2(NC) IC2.11(NC) IC2.12(NC) IC2.13(NC) IC2.14(NC) IC2.15(NC) IC2.16(NC) IC2.17(NC) IC2.18(NC) IC2.19(NC) IC2.20(NC)

### Notes on the sheet
- DCF77-Signalaufbereitung, Echtzeituhr
- DCF_Pullup an/aus
- Real Time Clock
- CON_DCF_1 und CON_DCF_2
  sind durch ein FFC_Kabel verbunden

## Sheet 6 of 6
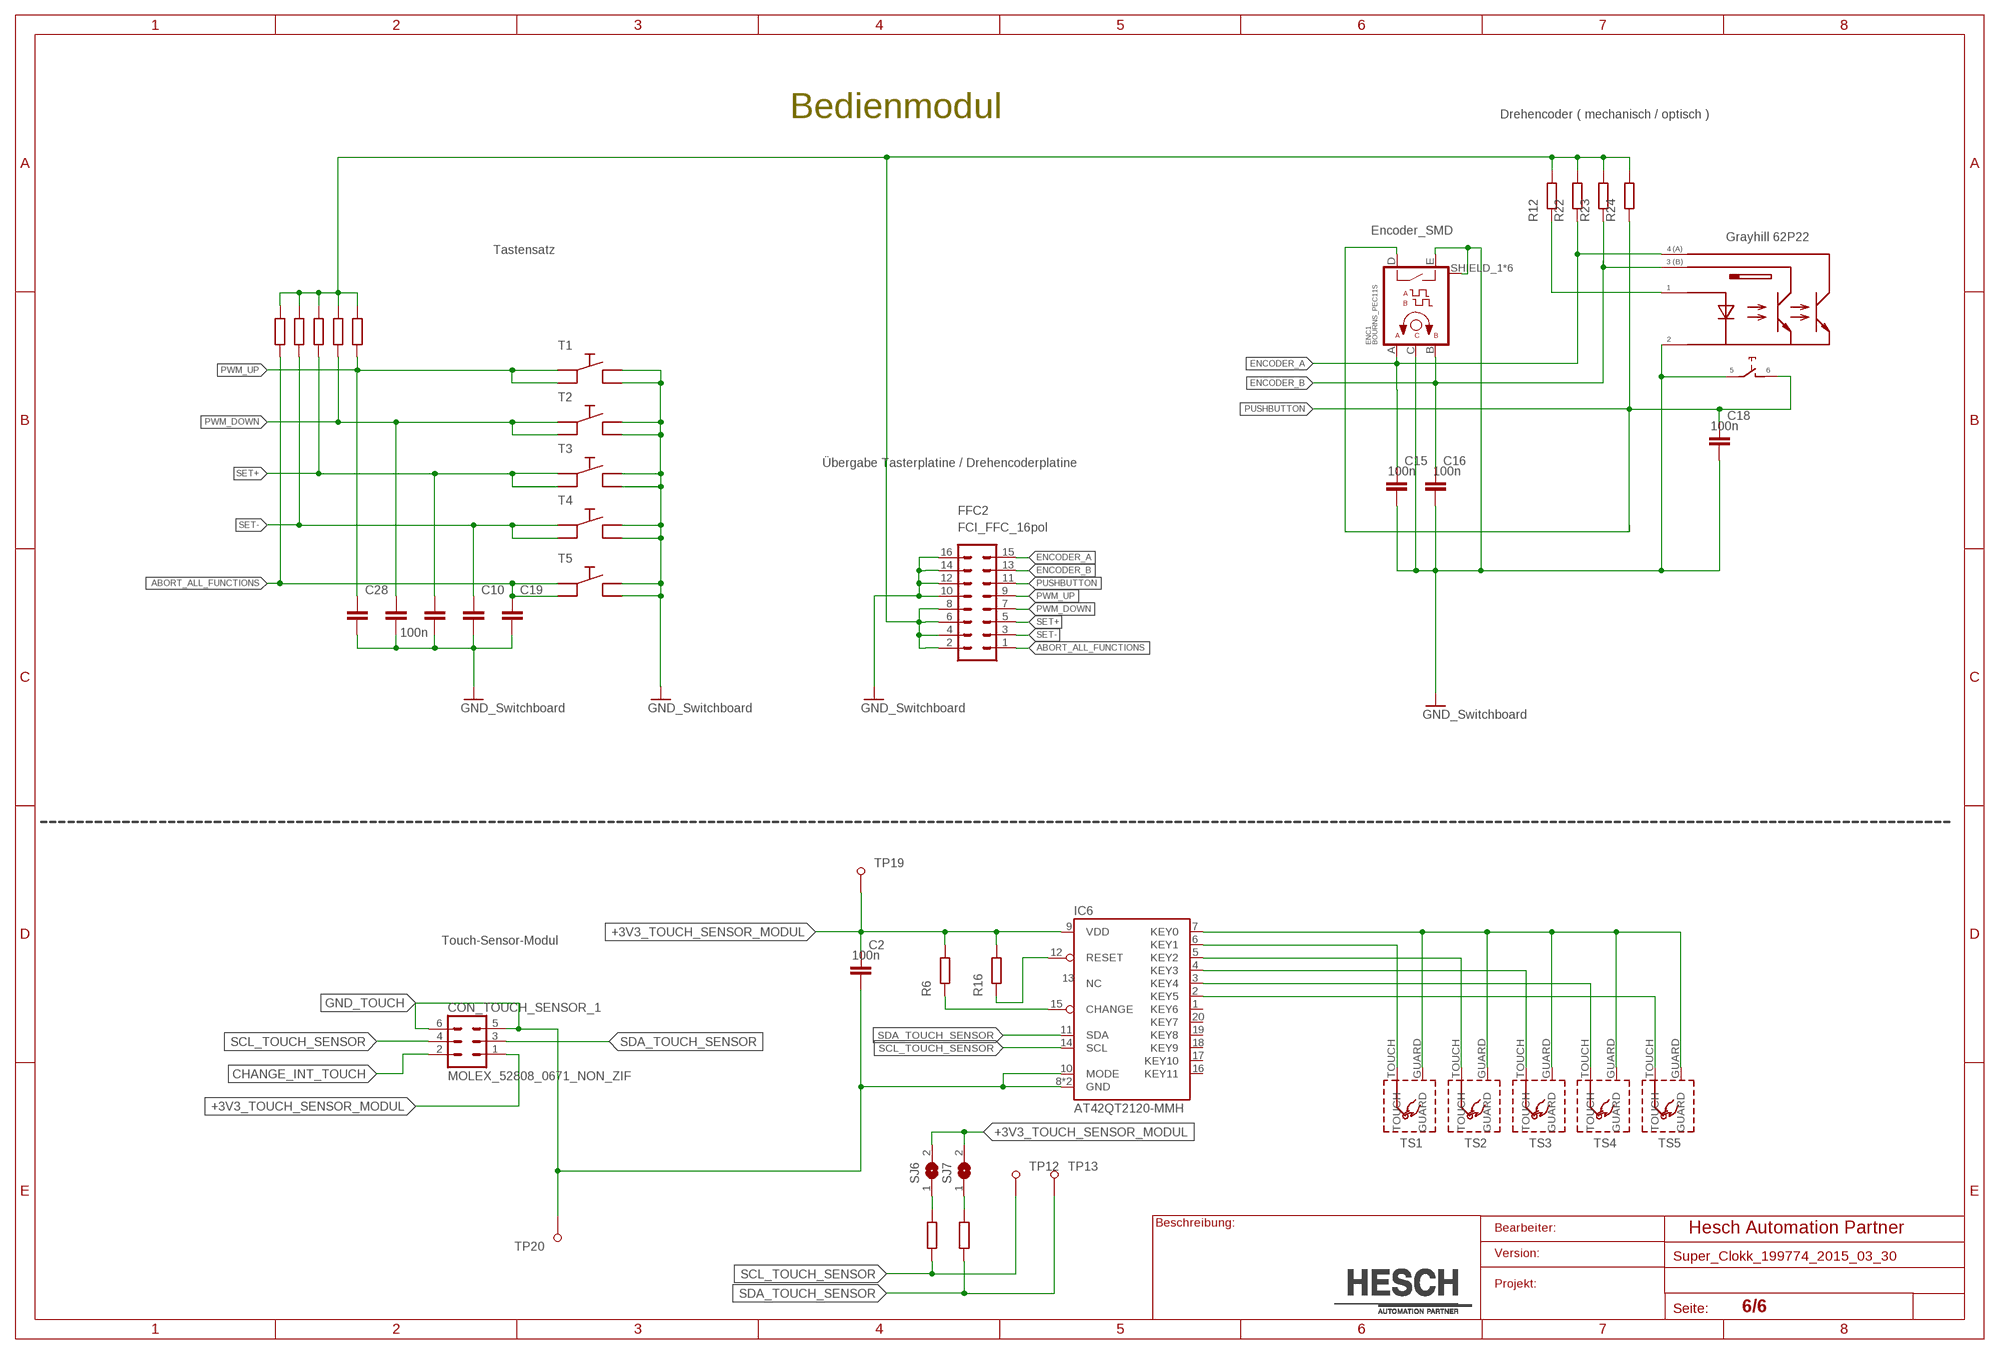
[diagram p5: schematic, sheet 6]

### Parts
C2  100n  C-EUC0805  [C0805]
C10  100n  C-EUC0805  [C0805]
C12  100n  C-EUC0805  [C0805]
C15  100n  C-EUC0805  [C0805]
C16  100n  C-EUC0805  [C0805]
C18  100n  C-EUC0805  [C0805]
C19  100n  C-EUC0805  [C0805]
C27  100n  C-EUC0805  [C0805]
C28  100n  C-EUC0805  [C0805]
CON_TOUCH_SENSOR_1  MOLEX_52808_0671_NON_ZIF  [MOLEX_52808-0671_NON_ZIF]
ENC1  BOURNS_PEC11S  [BOURNS_PEC11S]
ENC2  Grayhill 62P22  62P22  [62P22]
FFC2  FCI_FFC_16pol  MOLEX_52808-1671_NON_ZIF  [MOLEX_52808_1671_NON_ZIF]
IC6  AT42QT2120-MMH  [VQFN-20]
R6  10k  R-EU_R0805  [R0805]
R8  100k  R-EU_R0805  [R0805]
R9  100k  R-EU_R0805  [R0805]
R12  100R  R-EU_R0805  [R0805]
R16  10k  R-EU_R0805  [R0805]
R17  10k  R-EU_R0805  [R0805]
R19  10k  R-EU_R0805  [R0805]
R22  10k  R-EU_R0805  [R0805]
R23  10k  R-EU_R0805  [R0805]
R24  10k  R-EU_R0805  [R0805]
R25  100k  R-EU_R0805  [R0805]
R64  100k  R-EU_R0805  [R0805]
R72  100k  R-EU_R0805  [R0805]
SJ6  SJ  [SJ]
SJ7  SJ  [SJ]
T1  OMRON-B3S-1002P  [B3S-1002P]
T2  OMRON-B3S-1002P  [B3S-1002P]
T3  OMRON-B3S-1002P  [B3S-1002P]
T4  OMRON-B3S-1002P  [B3S-1002P]
T5  OMRON-B3S-1002P  [B3S-1002P]
TP12  PAD´S8  [THT-1X2,54]
TP13  PAD´S8  [THT-1X2,54]
TP19  PAD´S8  [THT-1X2,54]
TP20  PAD´S8  [THT-1X2,54]
TS1  TOUCH_SENSOR_14MM  [TOUCH_SENSOR_14MM]
TS2  TOUCH_SENSOR_14MM  [TOUCH_SENSOR_14MM]
TS3  TOUCH_SENSOR_14MM  [TOUCH_SENSOR_14MM]
TS4  TOUCH_SENSOR_14MM  [TOUCH_SENSOR_14MM]
TS5  TOUCH_SENSOR_14MM  [TOUCH_SENSOR_14MM]

### Nets
+3V3_TOUCH_SENSOR_MODUL: C2.1 CON_TOUCH_SENSOR_1.1 IC6.9(VDD) R6.2 R16.2 SJ6.2 SJ7.2 TP19.TP
ABORT_ALL_FUNCTIONS: C19.1 FFC2.1 R25.2 T5.1 T5.2
CHANGE_INT_TOUCH: CON_TOUCH_SENSOR_1.2 IC6.15(CHANGE) R6.1
ENCODER_A: C15.1 ENC1.A ENC2.4 FFC2.15 R22.1
ENCODER_B: C16.1 ENC1.B ENC2.3 FFC2.13 R23.1
GND_SWITCHBOARD: C10.2 C12.2 C15.2 C16.2 C18.2 C19.2 C27.2 C28.2 ENC1.C ENC1.E ENC1.SHIELD_1 ENC1.SHIELD_2(SHIELD_1) ENC1.SHIELD_3(SHIELD_1) ENC1.SHIELD_4(SHIELD_1) ENC1.SHIELD_5(SHIELD_1) ENC1.SHIELD_6(SHIELD_1) ENC2.2 ENC2.5 FFC2.10 FFC2.12 FFC2.14 FFC2.16 T1.3 T1.4 T2.3 T2.4 T3.3 T3.4 T4.3 T4.4 T5.3 T5.4 ; supply symbol labelled GND_Switchboard
GND_TOUCH: C2.2 CON_TOUCH_SENSOR_1.5 CON_TOUCH_SENSOR_1.6 IC6.8(GND) IC6.10(MODE) IC6.EXP.(GND) TP20.TP
N$17: IC6.7(KEY0) TS1.GUARD TS2.GUARD TS3.GUARD TS4.GUARD TS5.GUARD
N$22: ENC2.1 R12.1
N$23: IC6.12(RESET) R16.1
N$27: IC6.6(KEY1) TS1.TOUCH
N$28: IC6.5(KEY2) TS2.TOUCH
N$29: IC6.4(KEY3) TS3.TOUCH
N$30: IC6.3(KEY4) TS4.TOUCH
N$31: IC6.2(KEY5) TS5.TOUCH
N$33: R17.1 SJ6.1
N$34: R19.1 SJ7.1
PUSHBUTTON: C18.1 ENC1.D ENC2.6 FFC2.11 R24.1
PWM_DOWN: C27.1 FFC2.7 R9.2 T2.1 T2.2
PWM_UP: C28.1 FFC2.9 R8.2 T1.1 T1.2
SCL_TOUCH_SENSOR: CON_TOUCH_SENSOR_1.4 IC6.14(SCL) R17.2 TP12.TP
SDA_TOUCH_SENSOR: CON_TOUCH_SENSOR_1.3 IC6.11(SDA) R19.2 TP13.TP
SET+: C12.1 FFC2.5 R64.2 T3.1 T3.2
SET-: C10.1 FFC2.3 R72.2 T4.1 T4.2
SUPPLY_3V3_BEDIENMODUL: FFC2.2 FFC2.4 FFC2.6 FFC2.8 R8.1 R9.1 R12.2 R22.2 R23.2 R24.2 R25.1 R64.1 R72.1
Unconnected: IC6.1(KEY6) IC6.13(NC) IC6.16(KEY11) IC6.17(KEY10) IC6.18(KEY9) IC6.19(KEY8) IC6.20(KEY7)

### Notes on the sheet
- Bedienmodul | Drehencoder ( mechanisch / optisch )
- Encoder_SMD
- Tastensatz
- Übergabe Tasterplatine / Drehencoderplatine
- Touch-Sensor-Modul

## Library data of the parts
A1 = Summer -  FUCW03:FUCW03: Name des Bauteiles:Miniatursummer z.B. F/UCW 06 oder GCM 1206BX Daten:3..7 V / 30 mA Artikelnummer:#201050 Datenblatt:www.datasheet.com
A3 = DCF77 - Empfangsmodul (ELV):ELV: Name des Bauteiles: -->DCF77 Empfangsmodul Daten:Das speziell für den Empfang des DCF-2-Senders im Langwellenbereich bei 77,5 kHz konzipierte Empfangsmodul liefert an seinem Open-Collector-Ausgang bereits das demodulierte DCF-Signal. Die komplette Schaltung des DCF-Empfängers befindet sich auf einer besonders kleinen 27 x 17 mm messenden Leiterplatte und benötigt zum Betrieb nur eine Versorgungsspannung von 1,2 V bis 15 V bei einem Strom von lediglich 70 µA (bei 1,2 V). Das Modul eignet sich aufgrund der kompakten Bauweise besonders gut für den Einsatz in portablen Geräten. Artikelnummer:#keine feste Artikelnummer vorhanden / Atikel nicht lagermäßig vorhanden! Datenblatt:http://files.elv.de/Assets/Produkte/9/916/91610/Downloads/91610_DCF_Empfangsmodul_DCF_2_DS.pdf __________________________________________ generated by Eagle Description Tool am : 03.02.2015 13:52:04 erstellt von: Hm
C1 C2 C5-C7 C9-C12 C14-C16 C18-C21 C24-C28 = rcl:C-EU: CAPACITOR, European symbol
C3 C4 C8 C17 = resistor:C-EU: CAPACITOR, European symbol
C22 C23 C29 = rcl:CPOL-EU: POLARIZED CAPACITOR, European symbol
C30 C31 = Kondensator - GoldCaps:PANASONIC-EN&SD-SERIES: Name des Bauteiles: -->Doppelschicht Kondensator Daten:radial (stehend), 70°C, 5,5V Artikelnummer:#014000 Datenblatt:www.alldatasheet.com __________________________________________ generated by Eagle Description Tool am : 23.01.2014 13:04:36 erstellt von: Hm
CON_DCF_1 CON_DCF_2 CON_TOUCH_SENSOR_1 CON_TOUCH_SENSOR_2 POWER_CON_1 POWER_CON_2 = Connectors:MOLEX_52808_0671_NON_ZIF
D1-D6 D8-D10 = Dioden:BAS116H: Name des Bauteiles: -->BAS116H Daten:BAS116H Ultra Low Leakage Diode speziell für die energiesparende Verbindung von Goldcaps mit Echtzeituhren, extrem kleiner Leckstrom Artikelnummer:#105016 Datenblatt:www.alldatasheet.com __________________________________________ generated by Eagle Description Tool am : 29.01.2014 07:16:55 erstellt von: Hm
D7 = Dioden:SS24: Name des Bauteiles: SMD-Schottkydiode SS24 Daten: Bauform DO-214AA/SMB; 40 V / 2 A Artikelnummer:#105032 Datenblatt:
DIS1-DIS4 = LED - 8 x 8 Matrix:TOYO: Name des Bauteiles: -->Toyo 8 x 8 Matrix - D24882B-N1-WH1-0-W Daten:8 x 8 Matrix, weiß, 60,2 x 60,2 mm Artikelnummer:#k064153 Datenblatt:http://www.google.de/url?sa=t&rct=j&q=&esrc=s&source=web&cd=1&ved=0CCEQFjAA&url=http%3A%2F%2Fwww.toyo-led.com%2Fwp-content%2Fuploads%2F2013%2F12%2FD24882-NM1.pdf&ei=om7UVMf2HYnYaqm1gogL&usg=AFQjCNE1iihB7vWwqS2Zx0HqQpn89Eb1CA&bvm=bv.85464276,d.bGQ&cad=rja __________________________________________ generated by Eagle Description Tool am : 06.02.2015 08:35:22 erstellt von: Hm
ENC1 = ALPS:BOURNS_PEC11S
ENC2 = Grayhill:62P22: Grayhill 62P22 Optischer Drehencoder mit Taste Lebensdauer: 2.000 000 Umdrehungen
F2 = Sicherung - SMD PTC:1206L
FFC1 FFC2 = Connectors:MOLEX_52808-1671_NON_ZIF
IC1 = USB Treiber - CP2102:CP2102: Name des Bauteiles:USB/UART-Wandlerr Daten:SMD. QFN 28, Silicon LAB: CP2102-GMR Artikelnummer: #045194 Datenblatt:www.alldatascheet.com
IC2 = Echtzeituhr - RTC8564JE:RTC8564JE: Name des Bauteiles: -->RTC8564JE Daten:Bauform : VSO120 Artikelnummer:#045172 Datenblatt:www.alldatasheet.com __________________________________________ generated by Eagle Description Tool am : 23.01.2014 10:55:17 erstellt von: Hm
IC3 = LED Matrix Treiber - HT1632C:HT1632: Name des Bauteiles: -->HT1632-C Daten:Daten? Artikelnummer:#keine feste Artikelnummer vorhanden / Atikel nicht lagermäßig vorhanden! Datenblatt:http://www.google.de/url?sa=t&rct=j&q=&esrc=s&source=web&cd=1&cad=rja&uact=8&ved=0CCYQFjAA&url=http%3A%2F%2Fwww.adafruit.com%2Fdatasheets%2Fht1632cv120.pdf&ei=S_W4VLnGHYaAUcPdgng&usg=AFQjCNEyb6XhabBIDvYaB_79TpDHE7-nhQ&bvm=bv.83829542,d.d24 __________________________________________ generated by Eagle Description Tool am : 16.01.2015 12:26:05 erstellt von: Wl
IC4 = Spannungsregler - LD39050:LD39050: Name des Bauteiles: -->LD39050 Daten:• Input voltage from 1.5 to 5.5 V, Ultra low-dropout voltage (200 mV typ. at 500mA load), Very low quiescent current (20 μA typ. at no load, 100 μA typ. at 500 mA load, 1 μA max. in OFF mode), Very low noise without bypass capacitor, Output voltage tolerance: ± 2.0% @ 25 °C, 500 mA guaranteed output current, Wide range of output voltages available on request: 0.8 V to 4.5 V with 100 mV step and adjustable from 0.8 V, Logic-controlled electronic shutdown, Compatible with ceramic capacitor COUT = 1 μF, Internal current and thermal limit, Package DFN6 (3x3 mm), Temperature range: from -40 °C to 125 °C Artikelnummer:#keine feste Artikelnummer vorhanden / Atikel nicht lagermäßig vorhanden! Datenblatt:http://www.st.com/st-web-ui/static/active/en/resource/technical/document/datasheet/CD00227527.pdf __________________________________________ generated by Eagle Description Tool am : 08.08.2014 07:53:57 erstellt von: Wl
IC5 IC7 = Transistor - FET N Channel PMN28UN:PMN28: Name des Bauteiles: Trench FET PMN28UN N Channel Daten: VDSmax = 12 VDC , IDmax = 5,7 ADC , N Channel Artikelnummer:k061665 Datenblatt:
IC6 = Touch Controller - ATMEL AT42QT2120:AT42QT2120: Name des Bauteiles: -->AT42QT2120 Daten:siehe Datenblatt Artikelnummer:#k0640342 Datenblatt:http://www.google.de/url?sa=t&rct=j&q=&esrc=s&source=web&cd=2&cad=rja&uact=8&ved=0CCsQFjAB&url=http%3A%2F%2Fwww.atmel.com%2Fimages%2Fdoc9634.pdf&ei=ZZX1VL_gM8LXapupgbAJ&usg=AFQjCNHqkar1-a8vf3jhbpVpWSRg7JEKKg&bvm=bv.87269000,d.d2s __________________________________________ generated by Eagle Description Tool am : 03.03.2015 12:05:20 erstellt von: Hm
IC8 = atmel:MEGA32: MICROCONTROLLER 32 Kbytes FLASH 2 Kbytes SRAM 1 Kbytes eepROM USART 8-channel 10 bit ADC Source: www.atmel.com .. doc2503.pdf; MPN: ATMEGA32-16AU; OC_FARNELL: 9171274; OC_NEWARK: 69K6677
IC9 = Drucksensormodul - BMP180:BOSCH
IC10 = 40_er Reihe (DIN Europa):4093: Quad 2-input NAND schmitt trigger
IC11 = USB - Suppressor Dioden:TPD2E001: Name des Bauteiles: -->TPD2E001 Daten:Array / 3x3 QFN - DRS, IC USB ESD Protection Artikelnummer:#045293 Datenblatt:Siehe Hesch Suche ! __________________________________________ generated by Eagle Description Tool am : 28.11.2014 08:00:41 erstellt von: Hm
LED2 LED7 LED14 LED15 = led:LED: LED OSRAM: - CHIPLED LG R971, LG N971, LY N971, LG Q971, LY Q971, LO R971, LY R971 LH N974, LH R974 LS Q976, LO Q976, LY Q976 LO Q996 - Hyper CHIPLED LW Q18S LB Q993, LB Q99A, LB R99A - SideLED LS A670, LO A670, LY A670, LG A670, LP A670 LB A673, LV A673, LT A673, LW A673 LH A674 LY A675 LS A676, LA A676, LO A676, LY A676, LW A676 LS A679, LY A679, LG A679 - Hyper Micro SIDELED® LS Y876, LA Y876, LO Y876, LY Y876 LT Y87S - SmartLED LW L88C, LW L88S LB L89C, LB L89S, LG L890 LS L89K, LO L89K, LY L89K LS L896, LA L896, LO L896, LY L896 - TOPLED LS T670, LO T670, LY T670, LG T670, LP T670 LSG T670, LSP T670, LSY T670, LOP T670, LYG T670 LG T671, LOG T671, LSG T671 LB T673, LV T673, LT T673, LW T673 LH T674 LS T676, LA T676, LO T676, LY T676, LB T676, LH T676, LSB T676, LW T676 LB T67C, LV T67C, LT T67C, LS T67K, LO T67K, LY T67K, LW E67C LS E67B, LA E67B, LO E67B, LY E67B, LB E67C, LV E67C, LT E67C LW T67C LS T679, LY T679, LG T679 LS T770, LO T770, LY T770, LG T770, LP T770 LB T773, LV T773, LT T773, LW T773 LH T774 LS E675, LA E675, LY E675, LS T675 LS T776, LA T776, LO T776, LY T776, LB T776 LHGB T686 LT T68C, LB T68C - Hyper Mini TOPLED® LB M676 - Mini TOPLED Santana® LG M470 LS M47K, LO M47K, LY M47K Source: http://www.osram.convergy.de LUXEON: - LUMILED® LXK2-PW12-R00, LXK2-PW12-S00, LXK2-PW14-U00, LXK2-PW14-V00 LXK2-PM12-R00, LXK2-PM12-S00, LXK2-PM14-U00 LXK2-PE12-Q00, LXK2-PE12-R00, LXK2-PE12-S00, LXK2-PE14-T00, LXK2-PE14-U00 LXK2-PB12-K00, LXK2-PB12-L00, LXK2-PB12-M00, LXK2-PB14-N00, LXK2-PB14-P00, LXK2-PB14-Q00 LXK2-PR12-L00, LXK2-PR12-M00, LXK2-PR14-Q00, LXK2-PR14-R00 LXK2-PD12-Q00, LXK2-PD12-R00, LXK2-PD12-S00 LXK2-PH12-R00, LXK2-PH12-S00 LXK2-PL12-P00, LXK2-PL12-Q00, LXK2-PL12-R00 Source: www.luxeon.com KINGBRIGHT: KA-3528ASYC Source: www.kingbright.com
M1 = Motor - Vibrationsmotor:VIBROMOTOR: Name des Bauteiles: -->Vibrations Motor Daten:1,3 VDC - 3 VDC (Motor spez.), Imax (siehe Datenblatt) Artikelnummer:#keine feste Artikelnummer vorhanden / Atikel nicht lagermäßig vorhanden! Datenblatt:www.copal.de __________________________________________ generated by Eagle Description Tool am : 28.01.2014 11:08:41 erstellt von: Hm
Q2 = Quarz - HC49UP:HC49: Name des Bauteiles: -->HC49U/P Daten:16 MHz (16000000 Hz) Artikelnummer:#023006 Datenblatt:www.alldatasheet.com __________________________________________ generated by Eagle Description Tool am : 22.01.2014 13:23:52 erstellt von: Hm
R1-R12 R15-R30 R52 R53 R62-R67 R69-R72 R74-R100 = rcl:R-EU_: RESISTOR, European symbol
R13 R14 = resistor:R-EU_: RESISTOR, European symbol
SJ1-SJ7 SJ12-SJ15 = jumper:SJ: SMD solder JUMPER
T1-T5 = Taster - Omron B3S-1002P:OMRON: Name des Bauteiles:SMD Taster OMRON (Omron: B3S-1002P) Daten:Waschdicht, 4 Kontakte, Miniatur-Taster, 6 x 6 x 4,3 mm Artikelnummer:#088017 Datenblatt:www.datasheet.com
TP1-TP20 = PAD_s:PAD´S: Name des Bauteiles: div. PAD´s Daten: Hm Artikelnummer:#k.A Datenblatt:
TS1-TS5 = Sensor_Touch:TOUCH_SENSOR_14MM
XB3 = USB - Verbinder:MICRO
XW1 = Atmel - ISP_6   (AVR ISP MKII):WSL: Name des Bauteiles: Wannenstecker 6 pol. Daten: 6 pol. goldene Kontakte ! Artikelnummer:#131231 Datenblatt:www.datasheet.com / www.reichelt.de